# EAGLE schematic modem_tda (EAGLE 6.3)
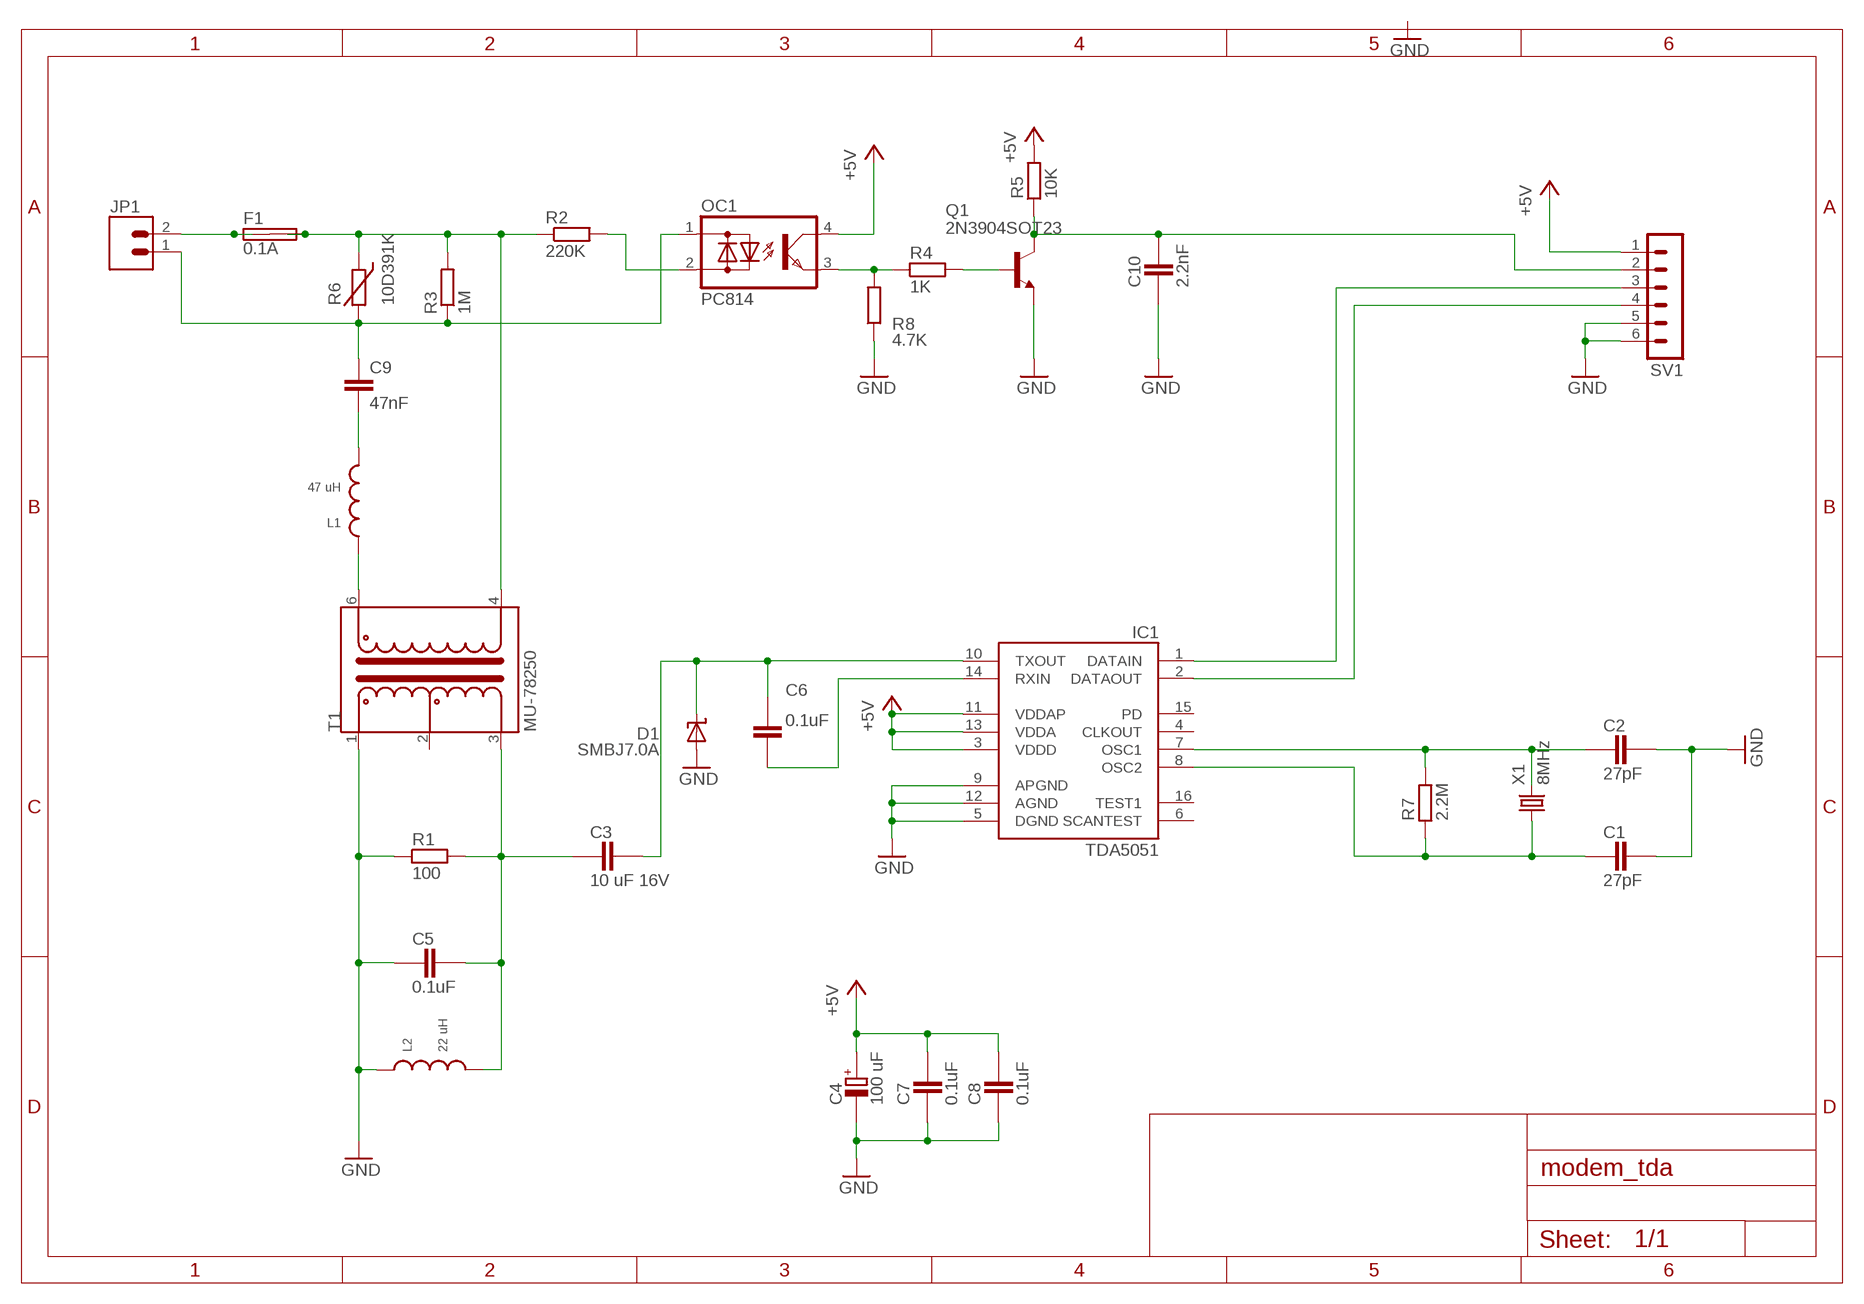
[diagram p0: schematic, sheet 1]

## Parts
C1  27pF  CAPACITOR_0805  [CAPC2012X145AN]
C2  27pF  CAPACITOR_0805  [CAPC2012X145AN]
C3  10 uF 16V  CAPACITOR_1206  [CAPC3215X168N]
C4  100 uF  POLARISED_U_CASE  [CAPMP6032X150N]
C5  0.1uF  CAPACITOR_0805  [CAPC2012X145AN]
C6  0.1uF  CAPACITOR_0805  [CAPC2012X145AN]
C7  0.1uF  CAPACITOR_0805  [CAPC2012X145AN]
C8  0.1uF  CAPACITOR_0805  [CAPC2012X145AN]
C9  47nF  CXXC10B6  [XC10B6]
C10  2.2nF  CAPACITOR_0805  [CAPC2012X145AN]
D1  SMBJ7.0A  SUPPRESSOR-SMBJ  [SMBJ]
F1  0.1A  SHK20L  [SHK20L]
IC1  TDA5051  [SO16W]
JP1  BLUE_TERM  [BLUE_TERM]
L1  47 uH  L-US  [CD43]
L2  22 uH  L-US  [CD43]
OC1  PC814  [DIL04]
Q1  2N3904SOT23  [SOT23-BEC]
R1  100  RESISTOR_0805  [RESC2012X70N]
R2  220K  R-EU_0309/12  [0309/12]
R3  1M  R-EU_0207/10  [0207/10]
R4  1K  RESISTOR_0805  [RESC2012X70N]
R5  10K  RESISTOR_0805  [RESC2012X70N]
R6  10D391K  VARISTOR  [MOV-10D]
R7  2.2M  RESISTOR_0805  [RESC2012X70N]
R8  4.7K  RESISTOR_0805  [RESC2012X70N]
SV1  MA06-1  [MA06-1]
T1  MU-78250  [6-PIN-DIL]
X1  8MHz  CRYSTALHC49S  [HC49/S]

## Nets
+5V: C4.+ C7.2 C8.2 IC1.3(VDDD) IC1.11(VDDAP) IC1.13(VDDA) OC1.4(C) R5.2 SV1.1
GND: C1.2 C2.2 C4.- C5.1 C7.1 C8.1 C10.1 D1.A IC1.5(DGND) IC1.9(APGND) IC1.12(AGND) L2.1 Q1.E R1.1 R8.1 SV1.5 SV1.6 T1.1
N$1: F1.1A F1.1B JP1.2
N$2: F1.2A F1.2B R2.1 R3.2 R6.2 T1.4
N$3: C9.1 JP1.1 OC1.1(AC1) R3.1 R6.1
N$4: OC1.2(AC2) R2.2
N$5: C9.2 L1.2
N$6: L1.1 T1.6
N$7: OC1.3(E) R4.1 R8.2
N$8: C3.1 C5.2 L2.2 R1.2 T1.3
N$9: C3.2 C6.2 D1.C IC1.10(TXOUT)
N$10: C10.2 Q1.C R5.1 SV1.2
N$11: C6.1 IC1.14(RXIN)
N$12: C2.1 IC1.7(OSC1) R7.2 X1.2
N$13: C1.1 IC1.8(OSC2) R7.1 X1.1
N$14: IC1.1(DATAIN) SV1.3
N$15: IC1.2(DATAOUT) SV1.4
N$16: Q1.B R4.2
Unconnected: IC1.4(CLKOUT) IC1.6(SCANTEST) IC1.15(PD) IC1.16(TEST1) T1.2

## Library data of the parts
C1-C3 C5-C8 C10 = ipc-7351-capacitor:CAPACITOR_
C4 = ipc-7351-capacitor:POLARISED_
C9 = rcl:CX: X CAPACITOR for power line
D1 = diode:SUPPRESSOR-: Suppressor diode
F1 = fuse:SHK20L: FUSE HOLDER 5 x 20 mm, SH contact, SHH1 Schukat, E1073 Buerklin
IC1 = nxp:TDA5051
JP1 = jlab:BLUE_TERM
L1 L2 = jlab_varistors:L-US
OC1 = optocoupler:PC814: SHARP OPTO COUPLER; OC_FARNELL: 9707662; OC_NEWARK: unknown
Q1 = transistor-npn:2N3904: NPN Transistor
R1 R4 R5 R7 R8 = ipc-7351-resistor:RESISTOR_
R2 R3 = rcl:R-EU_: RESISTOR, European symbol
R6 = jlab_varistors:VARISTOR
SV1 = con-lstb:MA06-1: PIN HEADER; OC_FARNELL: unknown; OC_NEWARK: unknown
T1 = jlab:MU-78250
X1 = crystal:CRYSTAL: CRYSTAL; OC_FARNELL: 1667008; OC_NEWARK: unknown